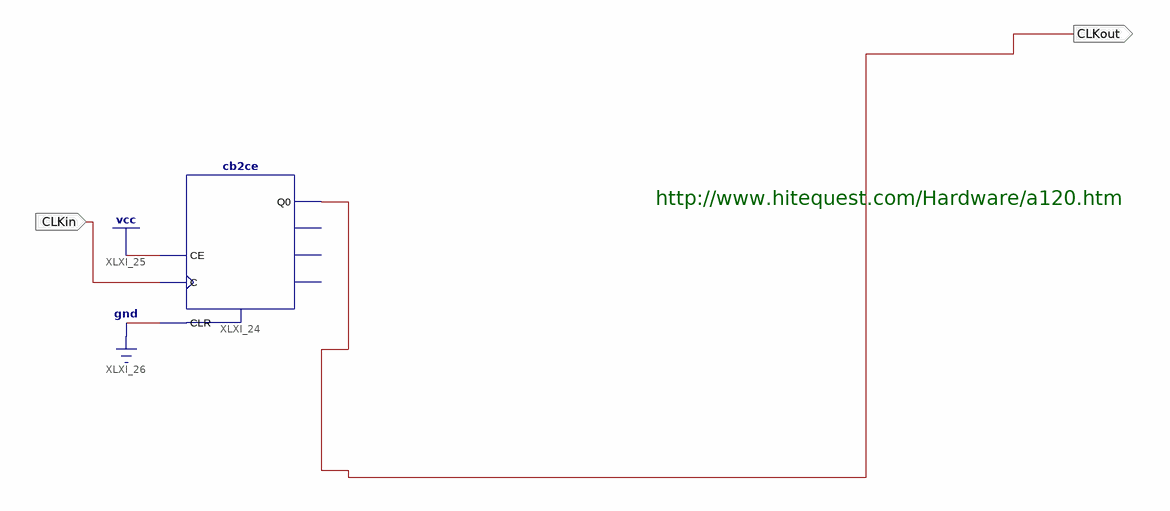
[diagram p0: schematic sheet 1]
// Xilinx ISE schematic divideby2.sch (spartan3e) as structural Verilog: 1 symbols, 2 ports
module divideby2 (
  input  CLKin,
  output CLKout
);

  cb2ce XLXI_24 (.C(CLKin), .CE(1'b1), .CLR(1'b0), .Q0(CLKout));  // open: CEO, Q1, TC

  // Notes on the sheet:
  //   http://www.hitequest.com/Hardware/a120.htm
endmodule
